# Altium project sanziqi.PrjPcb
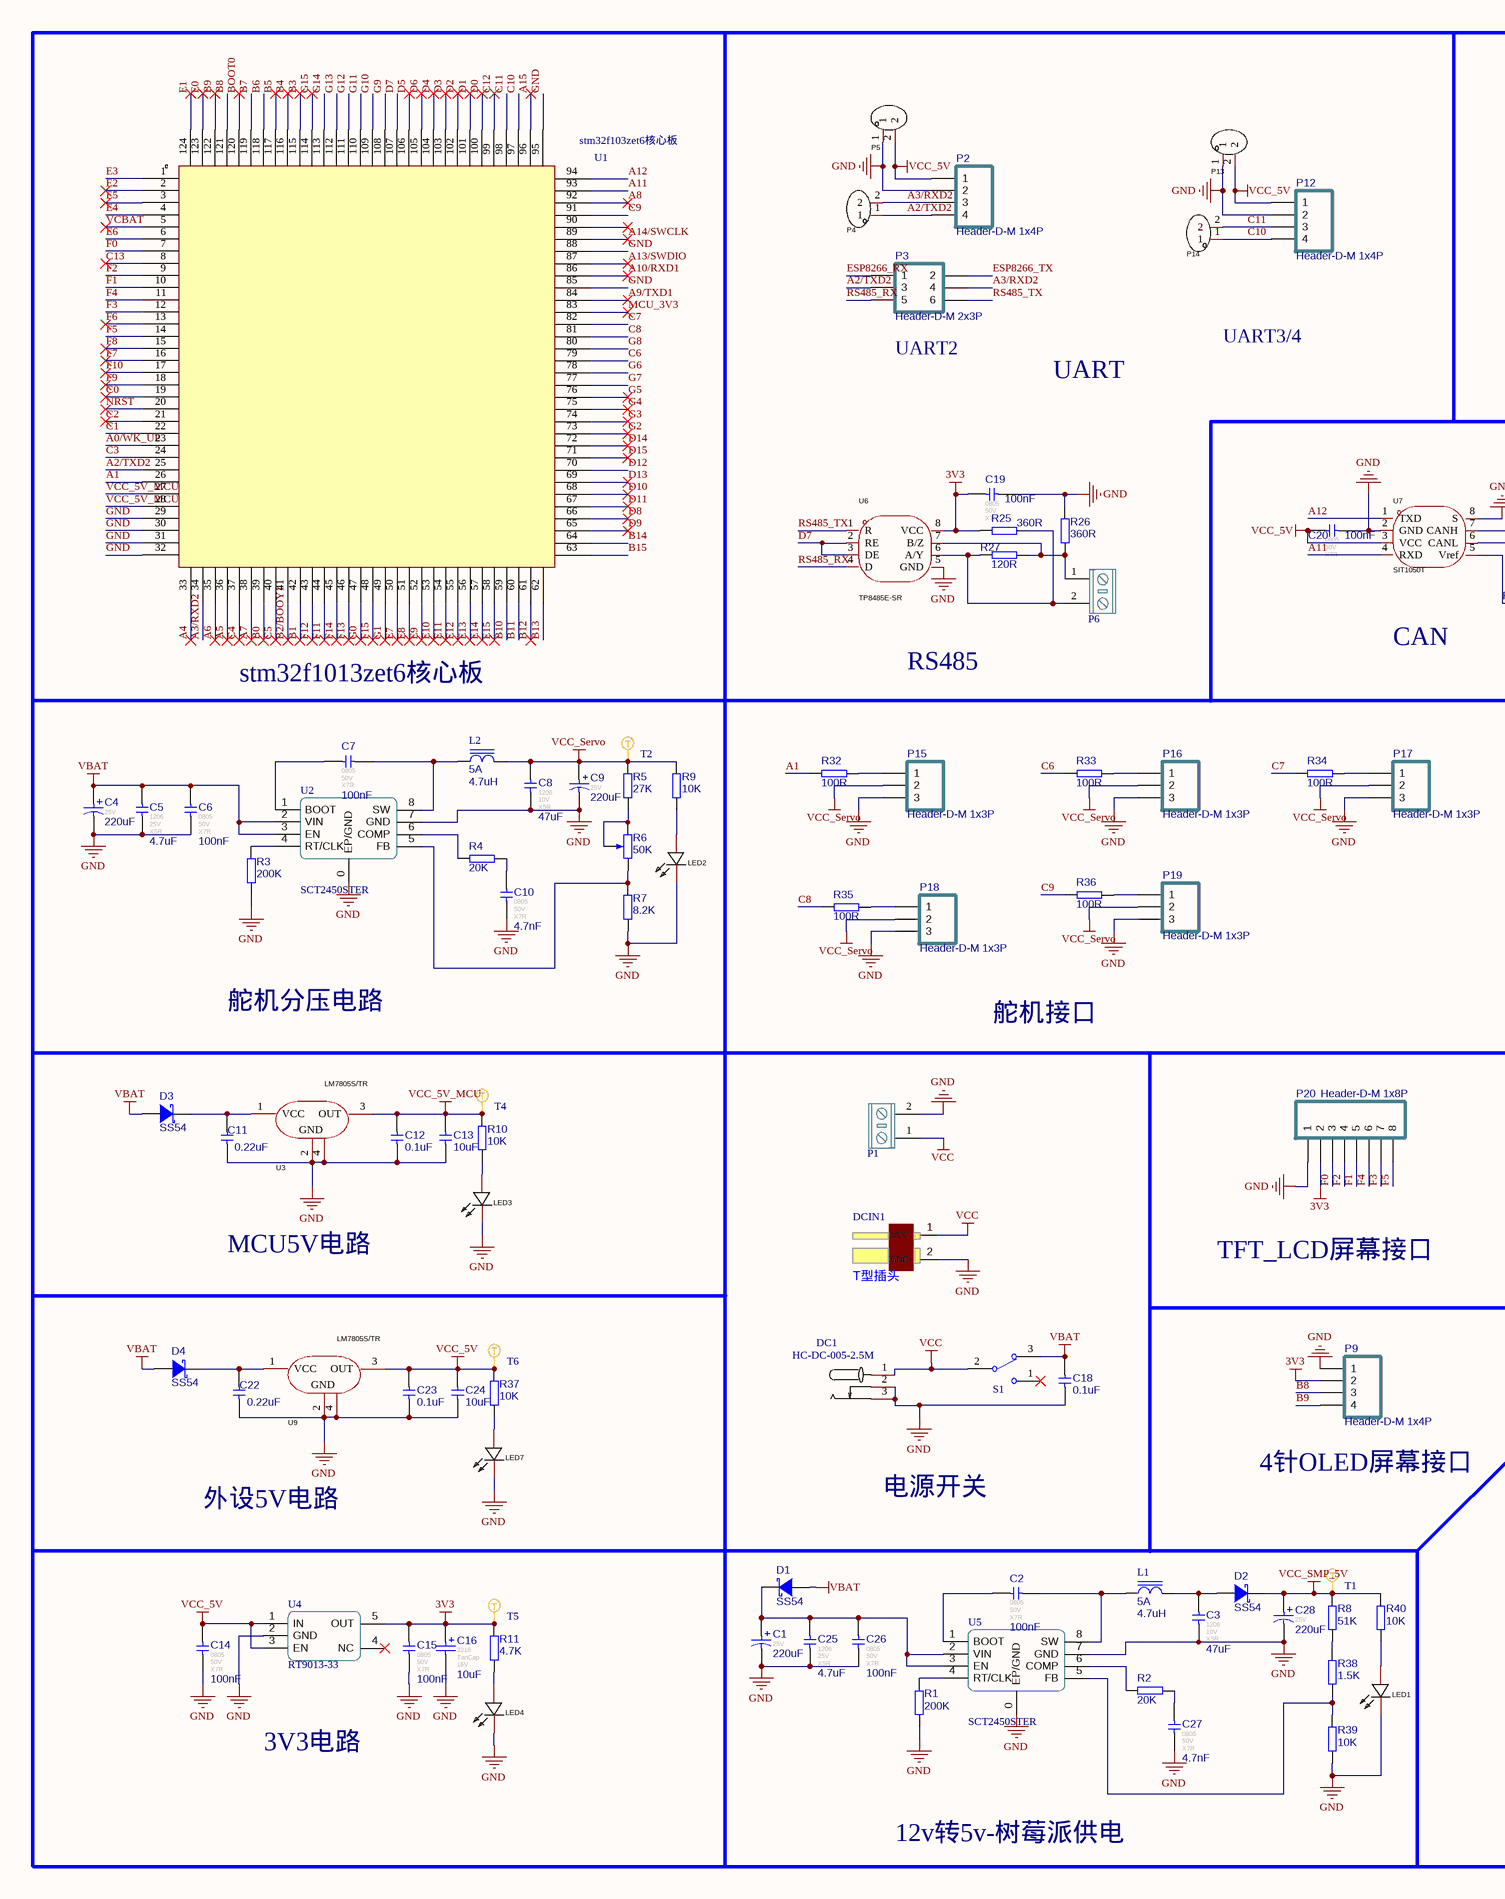
[diagram p0: sanziqi.SchDoc, left]
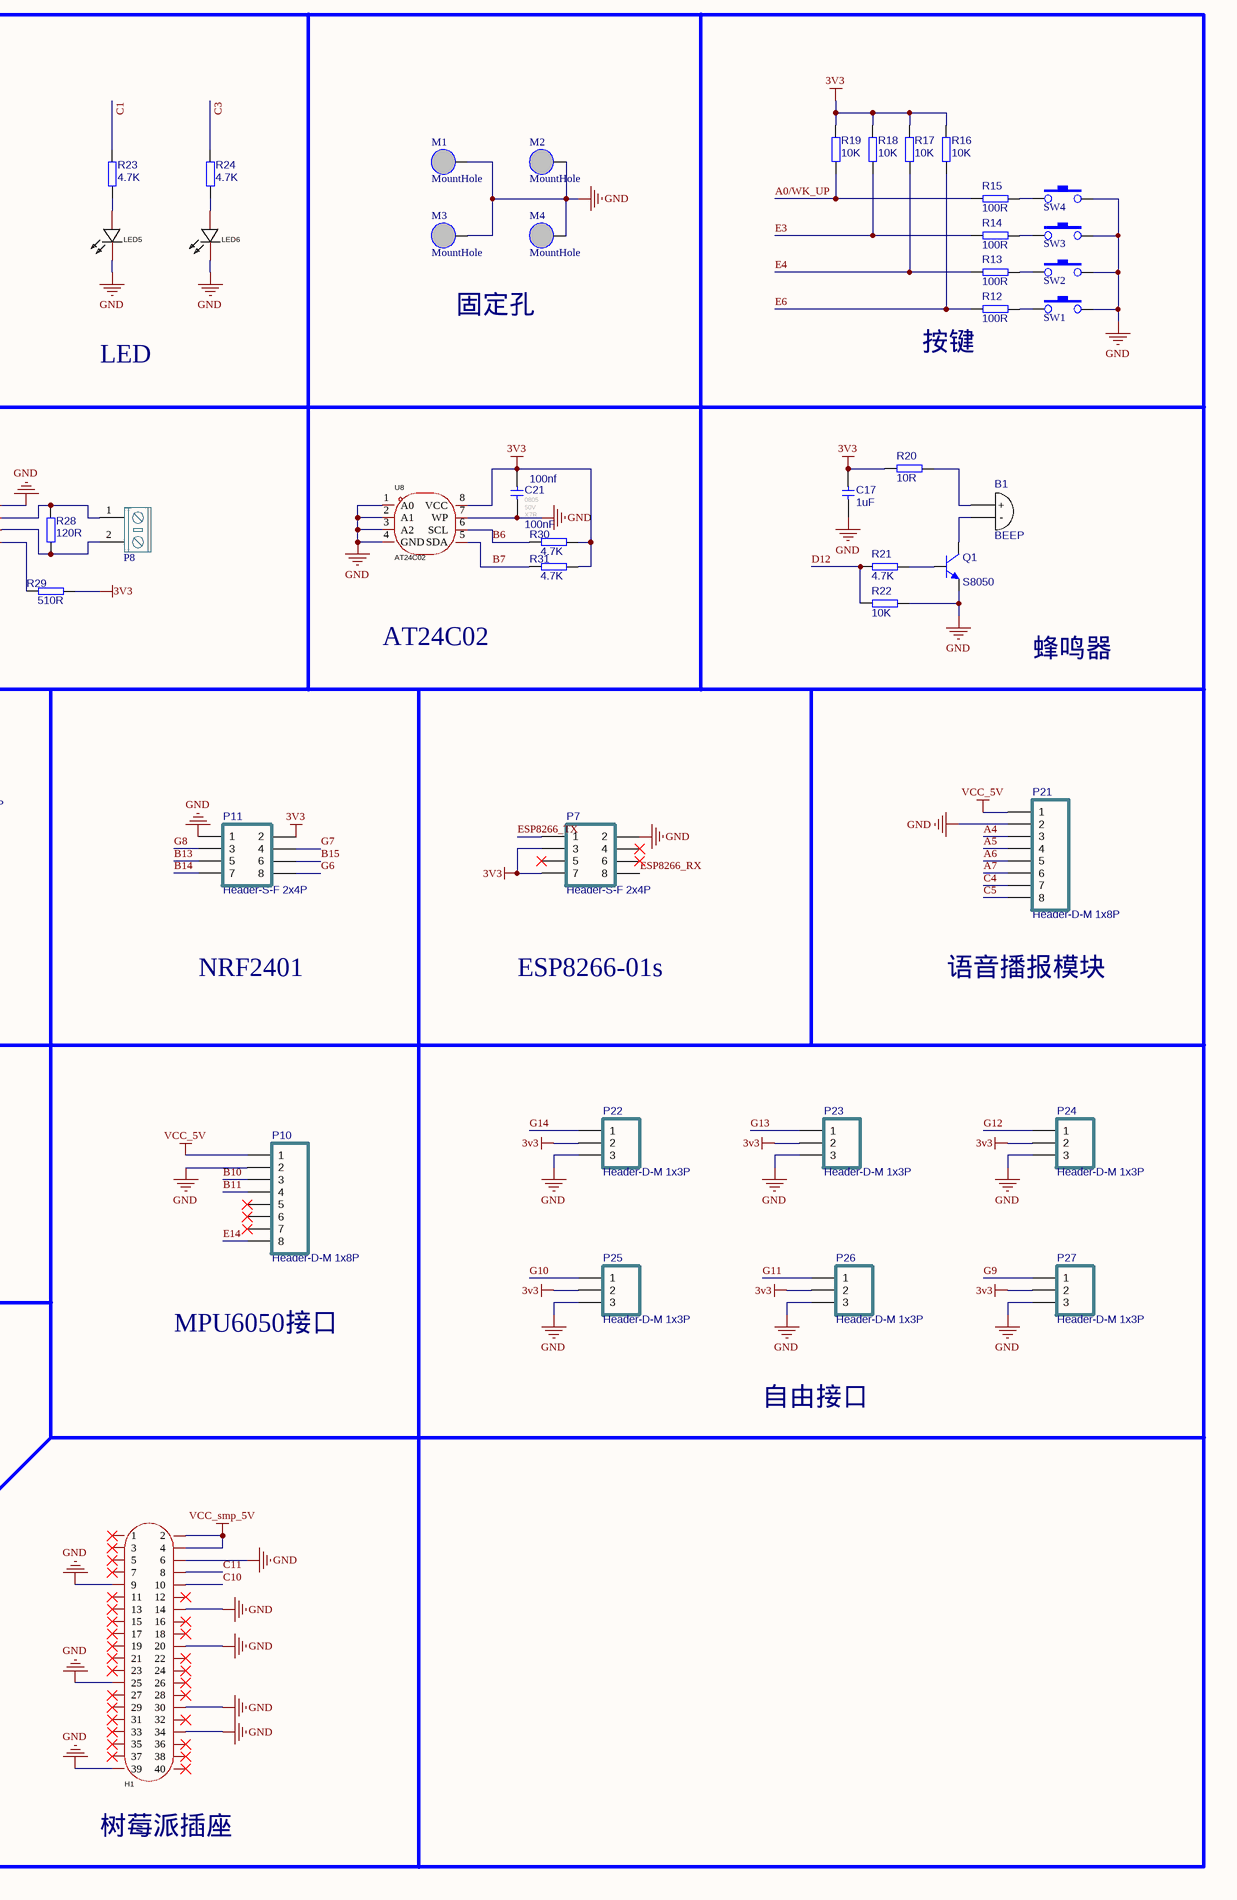
[diagram p1: sanziqi.SchDoc, right]
1 sheet, 136 parts. Net scope: global (net labels, ports and power ports of the same name join across sheets).
Board files: sanziqi.PcbDoc, siyin1.PcbDoc, siyin2.PcbDoc, PCB3.PcbDoc

## Sheet sanziqi.SchDoc
size A2

### Parts
B1  BEEP  [BEEP 9x5.5mm]
C1  value 220uF  Voltage: 25V  [CAP-TH_BD8.0-P3.50-D0.6-FD]  (hidden comment: 220uF 25V 铝电解)
C2  value 100nF  FootPrint: 0805  Voltage: 50V  Type: X7R  [C0805]  (hidden comment: 100nF 50V X7R)
C3  value 47uF  FootPrint: 1206  Voltage: 10V  Type: X5R  [CAPC3216[1206]S]  (hidden comment: 47uF 10V X5R)
C4  value 220uF  Voltage: 25V  [CAP-TH_BD8.0-P3.50-D0.6-FD]  (hidden comment: 220uF 25V 铝电解)
C5  value 4.7uF  FootPrint: 1206  Voltage: 25V  Type: X5R  [CAPC3216[1206]S]  (hidden comment: 4.7uF 25V X5R)
C6  value 100nF  FootPrint: 0805  Voltage: 50V  Type: X7R  [C0805]  (hidden comment: 100nF 50V X7R)
C7  value 100nF  FootPrint: 0805  Voltage: 50V  Type: X7R  [C0805]  (hidden comment: 100nF 50V X7R)
C8  value 47uF  FootPrint: 1206  Voltage: 10V  Type: X5R  [CAPC3216[1206]S]  (hidden comment: 47uF 10V X5R)
C9  value 220uF  Voltage: 25V  [CAP-TH_BD8.0-P3.50-D0.6-FD]  (hidden comment: 220uF 25V 铝电解)
C10  value 4.7nF  FootPrint: 0805  Voltage: 50V  Type: X7R  [C0805]  (hidden comment: 4.7nF 50V X7R)
C11  value 0.22uF  [C0805]
C12  value 0.1uF  [C0805]
C13  value 10uF  [C0805]
C14  value 100nF  FootPrint: 0805  Voltage: 50V  Type: X7R  [C0805]  (hidden comment: 100nF 50V X7R)
C15  value 100nF  FootPrint: 0805  Voltage: 50V  Type: X7R  [C0805]  (hidden comment: 100nF 50V X7R)
C16  value 10uF  FootPrint: 3216  Type: TanCap  Voltage: 16V  [CAP-T-S 3216]  (hidden comment: T-S 10uF 3216 16V)
C17  value 1uF  [C0805]
C18  value 0.1uF  [C0805]
C19  value 100nF  FootPrint: 0805  Voltage: 50V  Type: X7R  [C0805]  (hidden comment: 100nF 50V X7R)
C20  value 100nF  FootPrint: 0805  Voltage: 50V  Type: X7R  [C0805]  (hidden comment: 100nF 50V X7R)
C21  100nf  FootPrint: 0805  Voltage: 50V  Type: X7R  [C0805]
C22  value 0.22uF  [C0805]
C23  value 0.1uF  [C0805]
C24  value 10uF  [C0805]
C25  value 4.7uF  FootPrint: 1206  Voltage: 25V  Type: X5R  [CAPC3216[1206]S]  (hidden comment: 4.7uF 25V X5R)
C26  value 100nF  FootPrint: 0805  Voltage: 50V  Type: X7R  [C0805]  (hidden comment: 100nF 50V X7R)
C27  value 4.7nF  FootPrint: 0805  Voltage: 50V  Type: X7R  [C0805]  (hidden comment: 4.7nF 50V X7R)
C28  value 220uF  Voltage: 25V  [CAP-TH_BD8.0-P3.50-D0.6-FD]  (hidden comment: 220uF 25V 铝电解)
D1  SS54  [SMA-L[DO-214AC]]
D2  SS54  [SMA-L[DO-214AC]]
D3  SS54  [SMA-L[DO-214AC]]
D4  SS54  [SMA-L[DO-214AC]]
DC1  HC-DC-005-2.5M  [DC-005]
DCIN1  T型插头  [Wired T-Header ThroughHole]
H1  2.54mm 2*20P直排针  [HDR-TH_40P-P2.54-V-M-R2-C20-S2.54]  (value not drawn)
L1  value 4.7uH  Imax: 5A  [0630 TPC 7*7*3]  (hidden comment: 4.7uH 5A)
L2  value 4.7uH  Imax: 5A  [0630 TPC 7*7*3]  (hidden comment: 4.7uH 5A)
LED1  NCD0805R1  [LED0805-R-RD]  (value not drawn)
LED2  NCD0805R1  [LED0805-R-RD]  (value not drawn)
LED3  NCD0805R1  [LED0805-R-RD]  (value not drawn)
LED4  NCD0805R1  [LED0805-R-RD]  (value not drawn)
LED5  NCD0805R1  [LED0805-R-RD]  (value not drawn)
LED6  NCD0805R1  [LED0805-R-RD]  (value not drawn)
LED7  NCD0805R1  [LED0805-R-RD]  (value not drawn)
M1  MountHole  [M3-MountHole]  (no BOM)
M2  MountHole  [M3-MountHole]  (no BOM)
M3  MountHole  [M3-MountHole]  (no BOM)
M4  MountHole  [M3-MountHole]  (no BOM)
P1  KF/WJ/DG 30x connecter  [KF/WJ/DG 301-2p-5.0mm]  (value not drawn)
P2  Header-D-M 1x4P  [HDR1X4-M]
P3  Header-D-M 2x3P  [2.54mm 2*3p 直插]
P4  PM254-1-02-Z-8.5  [HDR-TH_2P-P2.54-V-F]  (value not drawn)
P5  PM254-1-02-Z-8.5  [HDR-TH_2P-P2.54-V-F]  (value not drawn)
P6  KF/WJ/DG 30x connecter  [KF/WJ/DG 301-2p-5.0mm]  (value not drawn)
P7  Header-S-F 2x4P  [HDR2.54-LI-2x4P]
P8  KF/WJ/DG 30x connecter  [KF/WJ/DG 301-2p-5.0mm]  (value not drawn)
P9  Header-D-M 1x4P  [HDR1X4-M]
P10  Header-D-M 1x8P  [HDR1X8-M]
P11  Header-S-F 2x4P  [HDR2.54-LI-2x4P]
P12  Header-D-M 1x4P  [HDR1X4-M]
P13  PM254-1-02-Z-8.5  [HDR-TH_2P-P2.54-V-F]  (value not drawn)
P14  PM254-1-02-Z-8.5  [HDR-TH_2P-P2.54-V-F]  (value not drawn)
P15  Header-D-M 1x3P  [HDR1X3-M]
P16  Header-D-M 1x3P  [HDR1X3-M]
P17  Header-D-M 1x3P  [HDR1X3-M]
P18  Header-D-M 1x3P  [HDR1X3-M]
P19  Header-D-M 1x3P  [HDR1X3-M]
P20  Header-D-M 1x8P  [HDR1X8-M]
P21  Header-D-M 1x8P  [HDR1X8-M]
P22  Header-D-M 1x3P  [HDR1X3-M]
P23  Header-D-M 1x3P  [HDR1X3-M]
P24  Header-D-M 1x3P  [HDR1X3-M]
P25  Header-D-M 1x3P  [HDR1X3-M]
P26  Header-D-M 1x3P  [HDR1X3-M]
P27  Header-D-M 1x3P  [HDR1X3-M]
Q1  S8050  [SOT-23]
R1  value 200K  [R0805]  (hidden comment: 200K ±1%)
R2  value 20K  [R0805]  (hidden comment: 20K ±1%)
R3  value 200K  [R0805]  (hidden comment: 200K ±1%)
R4  value 20K  [R0805]  (hidden comment: 20K ±1%)
R5  value 27K  [R0805]  (hidden comment: 27K ±1%)
R6  50K  [RESPOT3296W]
R7  value 8.2K  [R0805]  (hidden comment: 8.2K ±1%)
R8  value 51K  [R0805]  (hidden comment: 51K ±1%)
R9  value 10K  [R0805]  (hidden comment: 10K ±1%)
R10  value 10K  [R0805]  (hidden comment: 10K ±1%)
R11  value 4.7K  [R0805]  (hidden comment: 4.7K ±1%)
R12  value 100R  [R0805]  (hidden comment: 100R ±1%)
R13  value 100R  [R0805]  (hidden comment: 100R ±1%)
R14  value 100R  [R0805]  (hidden comment: 100R ±1%)
R15  value 100R  [R0805]  (hidden comment: 100R ±1%)
R16  value 10K  [R0805]  (hidden comment: 10K ±1%)
R17  value 10K  [R0805]  (hidden comment: 10K ±1%)
R18  value 10K  [R0805]  (hidden comment: 10K ±1%)
R19  value 10K  [R0805]  (hidden comment: 10K ±1%)
R20  value 10R  [R0805]  (hidden comment: 10R ±1%)
R21  value 4.7K  [R0805]  (hidden comment: 4.7K ±1%)
R22  value 10K  [R0805]  (hidden comment: 10K ±1%)
R23  value 4.7K  [R0805]  (hidden comment: 4.7K ±1%)
R24  value 4.7K  [R0805]  (hidden comment: 4.7K ±1%)
R25  value 360R  [R0805]  (hidden comment: 360R ±1%)
R26  value 360R  [R0805]  (hidden comment: 360R ±1%)
R27  value 120R  [R0805]  (hidden comment: 120R ±1%)
R28  value 120R  [R0805]  (hidden comment: 120R ±1%)
R29  value 510R  [R0805]  (hidden comment: 510R ±1%)
R30  value 4.7K  [R0805]  (hidden comment: 4.7K ±1%)
R31  value 4.7K  [R0805]  (hidden comment: 4.7K ±1%)
R32  value 100R  [R0805]  (hidden comment: 100R ±1%)
R33  value 100R  [R0805]  (hidden comment: 100R ±1%)
R34  value 100R  [R0805]  (hidden comment: 100R ±1%)
R35  value 100R  [R0805]  (hidden comment: 100R ±1%)
R36  value 100R  [R0805]  (hidden comment: 100R ±1%)
R37  value 10K  [R0805]  (hidden comment: 10K ±1%)
R38  value 1.5K  [R0805]  (hidden comment: 1.5K ±1%)
R39  value 10K  [R0805]  (hidden comment: 10K ±1%)
R40  value 10K  [R0805]  (hidden comment: 10K ±1%)
S1  SW-SPDT  [SS12D10]  (value not drawn)
SW1  SW-PB_V  [TSW SMD-3*6*2.5]  (value not drawn)
SW2  SW-PB_V  [TSW SMD-3*6*2.5]  (value not drawn)
SW3  SW-PB_V  [TSW SMD-3*6*2.5]  (value not drawn)
SW4  SW-PB_V  [TSW SMD-3*6*2.5]  (value not drawn)
T1  Testpoint-Pad  [testpoint-pad-1mm]  (value not drawn)  (no BOM)
T2  Testpoint-Pad  [testpoint-pad-1mm]  (value not drawn)  (no BOM)
T4  Testpoint-Pad  [testpoint-pad-1mm]  (value not drawn)  (no BOM)
T5  Testpoint-Pad  [testpoint-pad-1mm]  (value not drawn)  (no BOM)
T6  Testpoint-Pad  [testpoint-pad-1mm]  (value not drawn)  (no BOM)
U1  stm32f103zet6核心板  [stm32f103zet6核心板]
U2  SCT2450STER  [SOP-8E]
U3  LM7805S/TR  [TO-263-3_L8.6-W10.2-P2.54-LS14.4-BR]
U4  RT9013-33  [SOT-23-5]
U5  SCT2450STER  [SOP-8E]
U6  TP8485E-SR  [SOIC-8_L5.0-W4.0-P1.27-LS6.0-BL]
U7  SIT1050T  [SO-8_L4.9-W3.9-P1.27-LS5.9-BL]
U8  AT24C02  [SOP-8_L5.0-W4.0-P1.27-LS6.0-BL]
U9  LM7805S/TR  [TO-263-3_L8.6-W10.2-P2.54-LS14.4-BR]

### Nets
3V3: C15.1 C16.1 C17.2 C19.1 C21.2 P7.3 P7.7 P9.2 P11.2 P20.2 P22.2 P23.2 P24.2 P25.2 P26.2 P27.2 R11.2 R16.2 R17.2 R18.2 R19.2 R20.1 R25.1 R29.2 R30.2 R31.2 T5.1(T) U4.5(OUT) U6.8(VCC) U8.8(VCC)
GND: C1.2 C3.1 C4.2 C5.1 C6.1 C8.1 C9.2 C10.1 C11.1 C12.1 C13.1 C14.2 C15.2 C16.2 C17.1 C18.1 C19.2 C20.2 C21.1 C22.1 C23.1 C24.1 C25.1 C26.1 C27.1 C28.2 DC1.2 DC1.3 DCIN1.2(GND) H1.6 H1.9 H1.14 H1.20 H1.25 H1.30 H1.34 H1.39 LED1.2(-) LED2.2(-) LED3.2(-) LED4.2(-) LED5.2(-) LED6.2(-) LED7.2(-) M1.1 M2.1 M3.1 M4.1 P1.2 P2.2 P5.1 P7.2 P9.1 P10.2 P11.1 P12.2 P13.1 P15.3 P16.3 P17.3 P18.3 P19.3 P20.1 P21.2 P22.3 P23.3 P24.3 P25.3 P26.3 P27.3 Q1.2(E) R1.1 R3.1 R7.1 R22.2 R26.2 R39.1 SW1.2 SW2.2 SW3.2 SW4.2 U1.29 U1.30 U1.31 U1.32 U1.85 U1.88 U1.95 U2.0(EP/GND) U2.7(GND) U3.2(GND) U3.4(GND) U4.2(GND) U5.0(EP/GND) U5.7(GND) U6.5(GND) U7.2(GND) U7.8(S) U8.1(A0) U8.2(A1) U8.3(A2) U8.4(GND) U8.7(WP) U9.2(GND) U9.4(GND)
VBAT: C4.1 C5.2 C6.2 C18.2 D1.A D3.A D4.A S1.3 U2.2(VIN) U2.3(EN)
VCC: DC1.1 DCIN1.1(VCC) P1.1 S1.2
VCC_5V: C14.1 C20.1 C23.2 C24.2 P2.1 P5.2 P10.1 P12.1 P13.2 P21.1 R37.2 T6.1(T) U4.1(IN) U4.3(EN) U7.3(VCC) U9.3(OUT)
VCC_5V_MCU: C12.2 C13.2 R10.2 T4.1(T) U1.27 U1.28 U3.3(OUT)
VCC_Servo: C8.2 C9.1 L2.2 P15.2 P16.2 P17.2 P18.2 P19.2 R5.2 R9.2 T2.1(T)
VCC_smp_5V: C28.1 D2.K H1.2 H1.4 R8.2 R40.2 T1.1(T)
A0/WK_UP: R15.1 R19.1 U1.23
A1: R32.1 U1.26
A2/TXD2: P2.4 P3.3 P4.1 U1.25
A3/RXD2: P2.3 P3.4 P4.2 U1.34
A4: P21.3 U1.33
A5: P21.4 U1.36
A6: P21.5 U1.35
A7: P21.6 U1.38
A8: U1.92
A9/TXD1: U1.84
A10/RXD1: U1.86
A11: U1.93 U7.4(RXD)
A12: U1.94 U7.1(TXD)
A13/SWDIO: U1.87
A14/SWCLK: U1.89
A15: U1.96
B0: U1.39
B1: U1.42
B2/BOOY1: U1.41
B3: U1.115
B4: U1.116
B5: U1.117
B6: R30.1 U1.118 U8.6(SCL)
B7: R31.1 U1.119 U8.5(SDA)
B8: P9.3 U1.121
B9: P9.4 U1.122
B10: P10.3 U1.59
B11: P10.4 U1.60
B12: U1.61
B13: P11.5 U1.62
B14: P11.7 U1.64
B15: P11.6 U1.63
BOOT0: U1.120
C0: U1.19
C1: R23.2 U1.22
C2: U1.21
C3: R24.2 U1.24
C4: P21.7 U1.37
C5: P21.8 U1.40
C6: R33.1 U1.79
C7: R34.1 U1.82
C8: R35.1 U1.81
C9: R36.1 U1.91
C10: H1.10 P12.4 P14.1 U1.97
C11: H1.8 P12.3 P14.2 U1.98
C12: U1.99
C13: U1.8
D0: U1.100
D1: U1.101
D2: U1.102
D3: U1.103
D4: U1.104
D5: U1.106
D6: U1.105
D7: U1.107 U6.2(RE) U6.3(DE)
D8: U1.66
D9: U1.65
D10: U1.68
D11: U1.67
D12: R21.1 R22.1 U1.70
D13: U1.69
D14: U1.72
D15: U1.71
E0: U1.123
E1: U1.124
E2: U1.2
E3: R14.1 R18.1 U1.1
E4: R13.1 R17.1 U1.4
E5: U1.3
E6: R12.1 R16.1 U1.6
E7: U1.50
E8: U1.51
E9: U1.52
E10: U1.53
E11: U1.54
E12: U1.55
E13: U1.56
E14: P10.8 U1.57
E15: U1.58
ESP8266_RX: P3.1 P7.8
ESP8266_TX: P3.2 P7.1
F0: P20.3 U1.7
F1: P20.5 U1.10
F2: P20.4 U1.9
F3: P20.7 U1.12
F4: P20.6 U1.11
F5: P20.8 U1.14
F6: U1.13
F7: U1.16
F8: U1.15
F9: U1.18
F10: U1.17
F11: U1.44
F12: U1.43
F13: U1.46
F14: U1.45
F15: U1.48
G0: U1.47
G1: U1.49
G2: U1.73
G3: U1.74
G4: U1.75
G5: U1.76
G6: P11.8 U1.78
G7: P11.4 U1.77
G8: P11.3 U1.80
G9: P27.1 U1.108
G10: P25.1 U1.109
G11: P26.1 U1.110
G12: P24.1 U1.111
G13: P23.1 U1.112
G14: P22.1 U1.113
G15: U1.114
MCU_3V3: U1.83
NRST: U1.20
RS485_RX: P3.5 U6.4(D)
RS485_TX: P3.6 U6.1(R)
VCBAT: U1.5
NetB1_1: B1.1(+) R20.2
NetB1_2: B1.2(-) Q1.3(C)
NetC1_1: C1.1 C25.2 C26.2 D1.K U5.2(VIN) U5.3(EN)
NetC2_1: C2.1 U5.1(BOOT)
NetC2_2: C2.2 L1.1 U5.8(SW)
NetC3_2: C3.2 D2.A L1.2
NetC7_1: C7.1 U2.1(BOOT)
NetC7_2: C7.2 L2.1 U2.8(SW)
NetC10_2: C10.2 R4.2
NetC11_2: C11.2 D3.K U3.1(VCC)
NetC22_2: C22.2 D4.K U9.1(VCC)
NetC27_2: C27.2 R2.2
NetLED1_1: LED1.1(+) R40.1
NetLED2_1: LED2.1(+) R9.1
NetLED3_1: LED3.1(+) R10.1
NetLED4_1: LED4.1(+) R11.1
NetLED5_1: LED5.1(+) R23.1
NetLED6_1: LED6.1(+) R24.1
NetLED7_1: LED7.1(+) R37.1
NetP6_1: P6.1 R26.1 R27.2 U6.7(B/Z)
NetP6_2: P6.2 R25.2 R27.1 U6.6(A/Y)
NetP8_1: P8.1 R28.2 U7.7(CANH)
NetP8_2: P8.2 R28.1 U7.6(CANL)
NetP15_1: P15.1 R32.2
NetP16_1: P16.1 R33.2
NetP17_1: P17.1 R34.2
NetP18_1: P18.1 R35.2
NetP19_1: P19.1 R36.2
NetQ1_1: Q1.1(B) R21.2
NetR1_2: R1.2 U5.4(RT/CLK)
NetR2_1: R2.1 U5.6(COMP)
NetR3_2: R3.2 U2.4(RT/CLK)
NetR4_1: R4.1 U2.6(COMP)
NetR5_1: R5.1 R6.1(TOP) R6.ADJ
NetR6_2: R6.2(BOT) R7.2 U2.5(FB)
NetR8_1: R8.1 R38.2
NetR12_2: R12.2 SW1.1
NetR13_2: R13.2 SW2.1
NetR14_2: R14.2 SW3.1
NetR15_2: R15.2 SW4.1
NetR29_1: R29.1 U7.5(Vref)
NetR38_1: R38.1 R39.2 U5.5(FB)

Not connected (* = marked no-connect by the designer): H1 1* 3* 5* 7* 11* 12* 13* 15* 16* 17* 18* 19* 21* 22* 23* 24* 26* 27* 28* 29* 31* 32* 33* 35* 36* 37* 38* 40*; P7 4* 5* 6*; P10 5* 6* 7*; S1 1*; U1 90*; U4 4(NC)*

### Notes on the sheet
- UART3/4
- 固定孔
- (near P3) UART2
- UART
- LED
- (near R12) 按键
- CAN
- stm32f1013zet6核心板
- RS485
- AT24C02
- 蜂鸣器
- 舵机分压电路
- NRF2401
- ESP8266-01s
- 语音播报模块
- 舵机接口
- MCU5V电路
- TFT_LCD屏幕接口
- MPU6050接口
- 自由接口
- 电源开关
- (near P9) 4针OLED屏幕接口
- 外设5V电路
- 3V3电路
- 12v转5v-树莓派供电
- (near H1) 树莓派插座

### Library data of the parts
B1 = BEEP: 蜂鸣器
C1 C4 C9 C28 = E-S 220uF 25V : 直插电解电容 220uF 25v; Revision: V1.0; Type: 铝电解
C2 C6 C7 C14 C15 C19-C21 C26 = 100nF 50V X7R: 贴片瓷片电容; MLCC;; Revision: V1.0
  C21: Value: 100nF
C3 C8 = 47uF 1206 10V X5R: 贴片瓷片电容; MLCC; 1206(3216);; Revision: V1.0
C5 C25 = 4.7uF 1206 25V X5R: 贴片瓷片电容; MLCC; 1206(3216);; Revision: V1.0
C10 C27 = 4.7nF 50V X7R: 贴片瓷片电容; MLCC;; Revision: V1.0
C11 C22 = 0.22uF 0805: 贴片电容0805; Revision: V1.0
C12 C18 C23 = 0.1uF 0805: 贴片电容0805; Revision: V1.0
C13 C24 = 10uF 0805: 贴片电容0805; Revision: V1.0
C16 = T-S 10uF 3216 16V: 贴片钽电容 10uF 3216 16V; Revision: July-2002: Re-released for DXP Platform.
C17 = 1uF 0805: 贴片电容0805; Revision: V1.0
D1-D4 = SS54: SS54 肖特基二极管; Revision: V1.0; Value: SS54
DC1 = HC-DC-005-2.5M: Manufacturer: HCTL(华灿天禄); 3DModel: DC-IN-TH_KH-DC-005-2.5; Add into BOM: yes; Name: HC-DC-005-2.5M; Symbol: HC-DC-005-2.5M; Device: HC-DC-005-2.5M; link: https://atta.szlcsc.com/upload/public/pdf/source/20210716/C2847170_7F0110A0BEDEE81C68B76DF87AC8DA16.pdf; Supplier: LCSC; Supplier Part: C3010535; Manufacturer Part: HC-DC-005-2.5M; JLCPCB Part Class: ExtendedPart; Convert to PCB: yes; Origin Footprint: DC-IN-TH_KH-DC-005-2.5
DCIN1 = T_Header
H1 = 2.54mm 2*20P直排针: Manufacturer: BOOMELE(博穆精密); Symbol: Header-Male-2.54_2x20; Add into BOM: yes; Pin Structure: 2x20P; Circluar Pins/Square Pins: 方针; Current Rating (Max): 3A; Device: 2.54mm 2*20P直排针; LCSC Part Name: 间距:2.54mm 2x20P 直插 方针; Supplier Part: C50980; Manufacturer Part: 2.54mm 2*20P直排针; Supplier Footprint: 插件,P=2.54mm; JLCPCB Part Class: Extended Part; Datasheet: https://atta.szlcsc.com/upload/public/pdf/source/20151109/1457707572823.pdf; Supplier: LCSC; Convert to PCB: yes; Pitch: 2.54mm; Row Spacing: 2.54mm; Mounting Type: 直插; Number of Rows: 双排; Number of Pins: 40P; Voltage Rating (Max): -; Length of Mating Pin: 6mm; Insulation Height: -; Length of End Connection Pin: 3mm; Contact Material: 黄铜; Contact Plating: -; Operating Temperature Range: -40℃~+105℃; Color: 黑色
L1 L2 = Ind-Power: 功率电感; DCR: .5m; Published: 8-Jun-2000; Revision: July-2002: Re-released for DXP Platform.; Publisher: Altium Limited; Price(RMB): 0.000
LED1-LED7 = LED: Manufacturer: 国星光电; Symbol: FC-2012HRK-620D; Add into BOM: yes; Emitted Color: 红色; Forward Voltage (VF): 1.6V~2.6V; Power Dissipation: 65mW; Forward Current: 20mA; Dominant Wavelength: 615nm~630nm; Diode Configuration: 独立二极管; Lens Color: 无色透明; Luminous Intensity: 67mcd~195mcd; Viewing Angle: 130°; Device: NCD0805R1; Supplier: LCSC; Manufacturer Part: NCD0805R1; Supplier Part: C84256; JLCPCB Part Class: Basic Part; LCSC Part Name: NCD0805R1; Supplier Footprint: 0805; Datasheet: https://atta.szlcsc.com/upload/public/pdf/source/20200820/C84256_F0A75A43B3EAD75808600A0514C76B99.pdf; Convert to PCB: yes; Lamp Holder Type: -; Peak Wavelength: -; Color Temperature: -; Mounting Sytle: -; Operating Temperature: -30℃~+85℃
M1-M4 = MountHole: 固定孔
P1 P6 P8 = KF/WJ/DG 30x: 接线端子 2Pin
P2 P9 P12 = Header-D-M 1x4P: 1x4pin, 直插, 排针; Revision: V1.0; Value: Header-D-M 1x4P
P3 = Header-S-M 2x3P: 2x3pin, 贴片, 双排针; Revision: V1.0; Value: Header-D-M 2x3P
P4 P5 P13 P14 = PM254-1-02-Z-8.5: Manufacturer: HCTL(华灿天禄); Add into BOM: yes; Number of Holes: 2P; Pitch: 2.54mm; Holes Structure: 1x2P; Circular Hole / Square Hole: 方孔; Current Rating (Max): 3A; Holes Direction: 顶部; Name: PM254-1-02-Z-8.5; Symbol: PM254-1-02-Z-8.5; Device: PM254-1-02-Z-8.5; LCSC Part Name: 2.54mm 1x2P; Supplier Part: C2897365; Manufacturer Part: PM254-1-02-Z-8.5; Supplier Footprint: 插件,P=2.54mm; JLCPCB Part Class: Extended Part; Datasheet: https://atta.szlcsc.com/upload/public/pdf/source/20230609/534BE42964C679BDE98E061007C4ABD6.pdf; Supplier: LCSC; Convert to PCB: yes; Number of Rows: 单排; Row Spacing: -; Mounting Type: 直插; Voltage Rating (Max): -; Insulation Height: 8.5mm; Operating Temperature Range: -40℃~+105℃
P7 P11 = Header-S-F 2x4P: 2x4pin, 贴片, 双排座; Revision: V1.0; Value: Header-S-F 2x4P
P10 P20 P21 = Header-D-M 1x8P: 1x8pin, 直插, 排针; Revision: V1.0; Value: Header-D-M 1x8P
P15-P19 P22-P27 = Header-D-M 1x3P: 1x3pin, 直插, 排针; Revision: V1.0; Value: Header-D-M 1x3P
Q1 = NPN S8050: Discrete NPN Bipolar Transistor; Published: 8-Jun-2000; Revision: July-2002: Re-released for DXP Platform.; Publisher: Altium Limited; Price(RMB): 0.000; PartNumber: S8050
R1 R3 = Res-Chip_200K: 贴片电阻; Power: 1/8W; Revision: V1.0; Tolerance: ±1%
R2 R4 R25-R31 = Res-Chip_20K: 贴片电阻; Power: 1/8W; Revision: V1.0; Tolerance: ±1%
R5 R8 R38 = Res-Chip_27K: 贴片电阻; Power: 1/8W; Revision: V1.0; Tolerance: ±1%
R6 = Res-Adj-3p: 可调电阻; Value: 50K
R7 R39 = Res-Chip_8.2K: 贴片电阻; Power: 1/8W; Revision: V1.0; Tolerance: ±1%
R9 R10 R12-R19 R22 R37 R40 = Res-Chip-10K: 贴片电阻; Power: 1/8W; Revision: V1.0; Tolerance: ±1%
R11 R21 R23 R24 = Res-Chip-4.7K: 贴片电阻; Power: 1/8W; Revision: V1.0; Tolerance: ±1%
R20 = Res-Chip-10R: 贴片电阻; Power: 1/8W; Revision: V1.0; Tolerance: ±1%
R32-R36 = Res-Chip-100R: 贴片电阻; Power: 1/8W; Revision: V1.0; Tolerance: ±1%
S1 = SW-SPDT: 单刀双掷开关 3脚船型、钮子、拨动开关 SPDT Subminiature Toggle Switch; Published: 24-Mar-1999; Publisher: Altium Limited; Price(RMB): 0.000
SW1-SW4 = SW-PB_V: SWITCH
T1 T2 T4-T6 = Testpoint-Pad-S: 测试点，就是个焊盘
U2 U5 = SCT2450: 3.8V-36V Vin, 5A, High Efficiency Synchronous Step-down DCDC Converter / with Programmable Frequency
U3 U9 = LM7805S/TR: Manufacturer: HGSEMI(华冠); Add into BOM: yes; Symbol: LM7805S/TR; Device: LM7805S/TR; LCSC Part Name: 固定电压稳压器; Supplier Part: C507146; Manufacturer Part: LM7805S/TR; Supplier Footprint: TO-263-3; JLCPCB Part Class: Extended Part; Datasheet: https://atta.szlcsc.com/upload/public/pdf/source/20211101/54C90BF39C07253AC431AF453924CB99.pdf; Supplier: LCSC; Convert to PCB: yes; Output Type: -
U4 = RT9013-33: 3.3V 500mA SOT-23-5 LDO
U6 = TP8485E-SR: Manufacturer: 3PEAK(思瑞浦); Add into BOM: yes; Types: 收发器; Number of Driver: 1; Supply Voltage: 3V~5.5V; Data Rate: 250Kbps; Node Number: 256; ESD Protect: ±18kV; Symbol: TP8485E-SR; Device: TP8485E-SR; LCSC Part Name: ±18K ESD保护，全故障安全RS-485收发器; Supplier Part: C94206; Manufacturer Part: TP8485E-SR; Supplier Footprint: SOIC-8; JLCPCB Part Class: Extended Part; Datasheet: https://atta.szlcsc.com/upload/public/pdf/source/20170120/1484891310884.pdf; Supplier: LCSC; Convert to PCB: yes; Number of receiver: 1; Operating Temperature: -40℃~+125℃
U7 = SIT1050T: Manufacturer: SIT(芯力特); Add into BOM: yes; Data Rate: 1Mbps; Supply Voltage: 4.5V~5.5V; Supply Current: 70mA; Symbol: SIT1050T; Device: SIT1050T; LCSC Part Name: SIT1050 5V供电，±40V接口耐压，1Mbps高速CAN总线收发器; Supplier Part: C313021; Manufacturer Part: SIT1050T; Supplier Footprint: SO-8; JLCPCB Part Class: Extended Part; Datasheet: https://atta.szlcsc.com/upload/public/pdf/source/20190522/C313021_F295A63AE262020D1D58DBA99C3629E3.pdf; Supplier: LCSC; Convert to PCB: yes; Type: CAN收发器; Operating Temperature: -40℃~+125℃
U8 = AT24C02_C688857: Manufacturer: IDCHIP(英锐芯); Add into BOM: yes; Symbol: AT24C02; Device: AT24C02_C688857; LCSC Part Name: 24C02 2Kbit电可擦除PROM; Supplier Part: C688857; Manufacturer Part: AT24C02; Supplier Footprint: SOP-8; JLCPCB Part Class: Extended Part; Datasheet: https://atta.szlcsc.com/upload/public/pdf/source/20200619/C688857_168265888F77B455D6D4136881F4BB15.pdf; Supplier: LCSC; Convert to PCB: yes